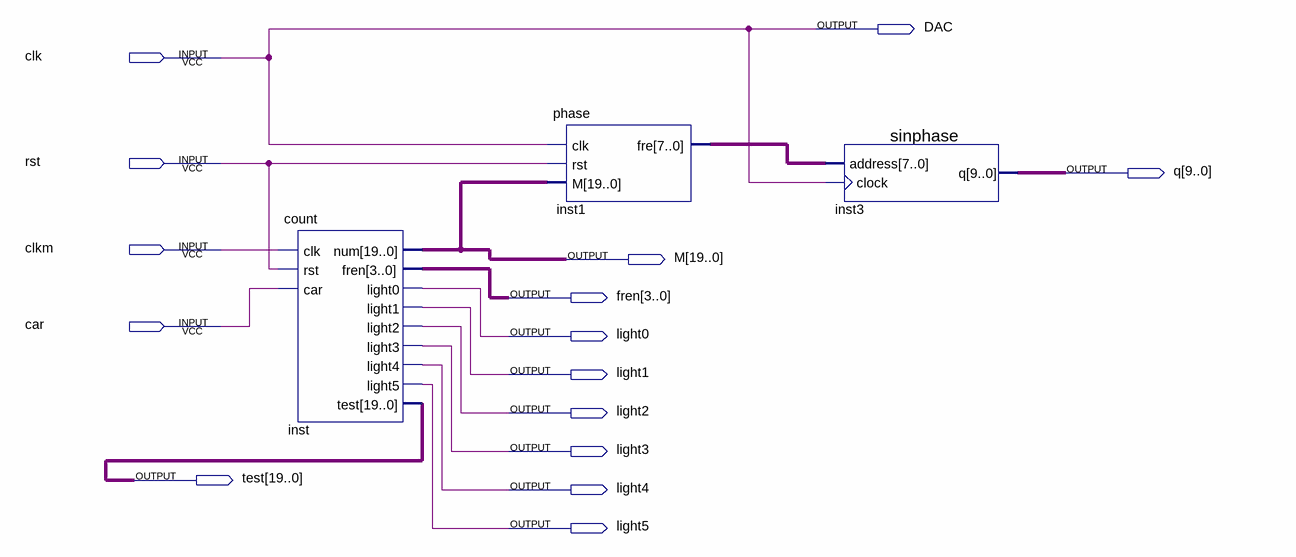
[diagram p0: schematic sheet]
// Quartus schematic demo.bdf as structural Verilog: 3 symbols, 15 pins
module demo (
  input  clk,
  input  rst,
  input  clkm,
  input  car,
  output DAC,
  output [9:0] q,
  output [19:0] M,
  output [3:0] fren,
  output light0,
  output light1,
  output light2,
  output light3,
  output [19:0] test,
  output light4,
  output light5
);

  wire [7:0] inst1_fre;

  count inst (
    .clk(clkm), .rst(rst), .car(car), .num(M), .fren(fren), .light0(light0), .light1(light1),
    .light2(light2), .light3(light3), .light4(light4), .light5(light5), .test(test));
  phase inst1 (.clk(clk), .rst(rst), .M(M), .fre(inst1_fre));
  sinphase inst3 (.address(inst1_fre), .clock(clk), .q(q));

  assign DAC = clk;
endmodule
